# EAGLE design IR_Badge_2018 (EAGLE 9.1.1)
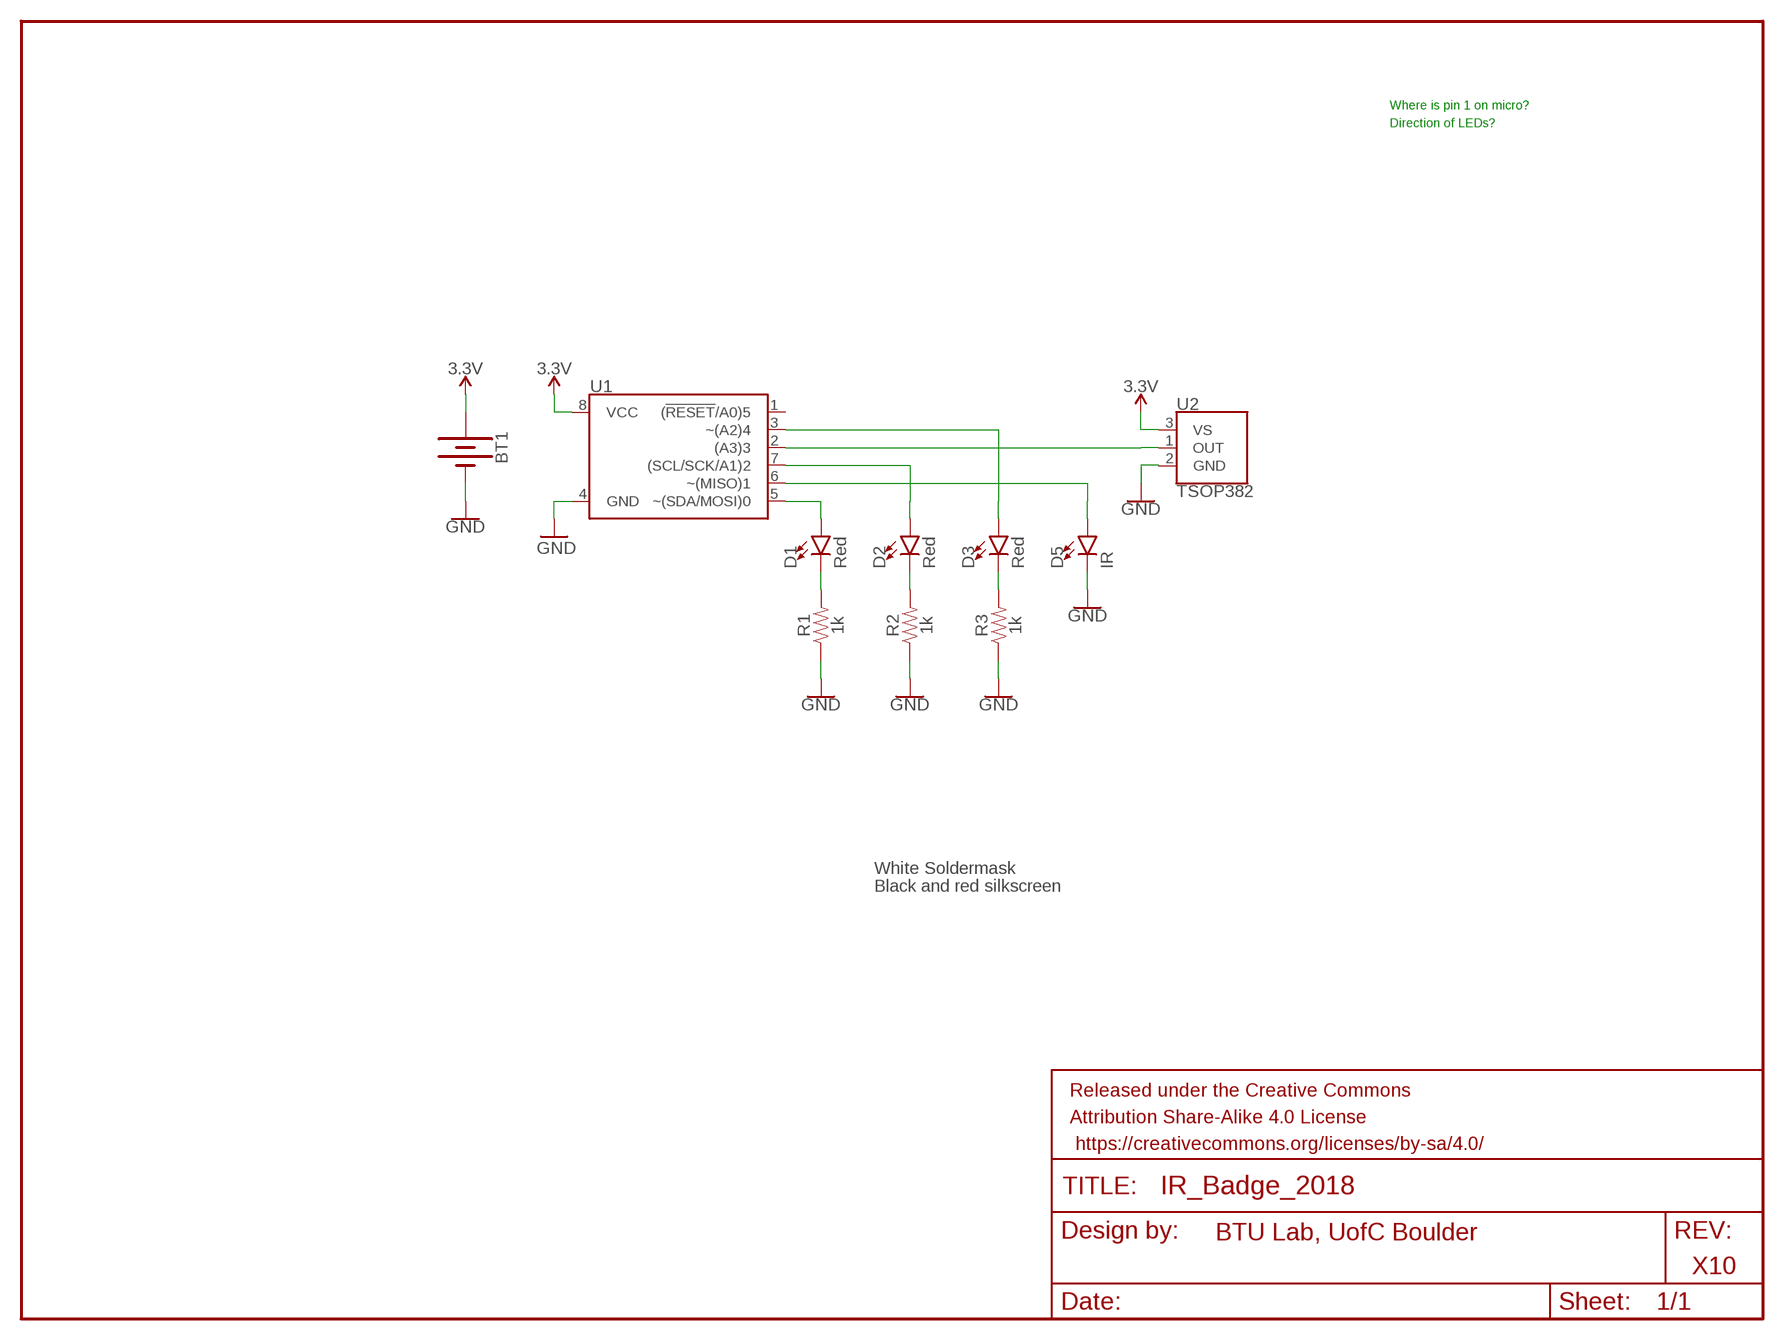
[diagram p0: schematic, sheet 1]

## Parts
BT1  BATTERY-20MM_PTH  [BATTCOM_20MM_PTH]
D1  Red  LEDRED  [LED_5MM_EXTRASILK]
D2  Red  LEDRED  [LED_5MM_EXTRASILK]
D3  Red  LEDRED  [LED_5MM_EXTRASILK]
D5  IR  LEDNS  [LED_5MM_NOSILK]
FRAME1  FRAME-LETTER  [CREATIVE_COMMONS]
R1  1k  RESISTOR  [RESISTOR]
R2  1k  RESISTOR  [RESISTOR]
R3  1k  RESISTOR  [RESISTOR]
U1  ATTINY85-ARDUINODIP  [DIP-8]
U2  TSOP382  [TSOP382-HORIZONTAL]

## Nets
3.3V: BT1.1(+) U1.8(VCC) U2.3(VS)
GND: BT1.2(-) D5.K(C) R1.P$1 R2.P$1 R3.P$1 U1.4(GND) U2.2(GND)
N$1: D1.A U1.5(~(SDA/MOSI)0)
N$2: D2.A U1.7((SCL/SCK/A1)2)
N$3: D1.K(C) R1.P$2
N$4: D3.A U1.3(~(A2)4)
N$5: D2.K(C) R2.P$2
N$7: D3.K(C) R3.P$2
N$8: D5.A U1.6(~(MISO)1)
N$9: U1.2((A3)3) U2.1(OUT)
Unconnected: U1.1((!RESET!/A0)5)

## Notes on the sheet
- Where is pin 1 on micro?
- Direction of LEDs?
- White Soldermask
- Black and red silkscreen
- BTU Lab, UofC Boulder
- X10

## Library data of the parts
BT1 = SparkFun-Batteries:BATTERY: Battery - Single Cell A variety of battery chemistries, sizes, and footprints. Device List: 20MM_PTH - Coin Cell Battery Holder - 20mm (PTH) <https://www.sparkfun.com/products/783> 20MM_PTH_KIT- Coin Cell battery Holder - 20 mm (PTH) <http://www.sparkfun.com/products/783>kit version with special mask 6.8MM_PTH - Coin Cell Battery Holder - 6.8MM(SMD) <https://www.digikey.com/product-detail/en/seiko-instruments/MS621FE-FL11E/728-1057-ND/1889208?WT.srch=1&gclid=CNOQ5a6LzdQCFZS2wAodXCkE0g> 12MM_SMD - Coin Cell Battery Holder - 12mm (SMD) <https://www.sparkfun.com/products/10592> 12MM_PTH - Coin Cell Battery Holder - 12mm (PTH) <https://www.sparkfun.com/products/7948> 20MM_SMD - 20mm Coin Cell Battery Holder (SMD) (2 legs) Used on the Big Time Watch Kit <https://www.sparkfun.com/products/11734> 20MM_SMD_4LEGS - Coin Cell Battery Holder - 20mm (SMD) <https://www.sparkfun.com/products/11892> 20MM_SMD_4LEGS_OVERPASTE - Coin Cell Battery Holder - 20mm (SMD) <https://www.sparkfun.com/products/11892> (Over-paste on the legs) 24.5MM_PTH - Coin Cell Battery Holder - 24.5mm (PTH) <https://www.sparkfun.com/products/8863> 9V - 9V Battery Holder - PC Mount Used on the SparkFun SparkPunk Sound Kit <https://www.sparkfun.com/products/11177> and SparkFun SparkPunk Sequencer Kit <https://www.sparkfun.com/products/12707> 18650 - Battery Holder - 18650 (PTH) <https://www.sparkfun.com/products/13113> AA - Battery Holder - 1xAA (PTH) <https://www.sparkfun.com/products/7949> AAA - Battery Holder - 1xAAA (PTH) <https://www.sparkfun.com/products/12718> AA_KIT - Battery Holder - 1xAA (PTH) <https://www.sparkfun.com/products/7949> Special kit package - pads only have exposed copper on one side of the board. AAA_KIT - Battery Holder - 1xAAA (PTH) <https://www.sparkfun.com/products/12718> Special kit package - pads only have exposed copper on one side of the board.; PROD_ID: BATT-09031; SF_SKU: PRT-00783
D1-D3 D5 = SparkX:LED
FRAME1 = SparkFun-Aesthetics:FRAME-LETTER: Schematic Frame - Letter Standard 8.5x11 US Letter frame
R1-R3 = esp8266_ir_blaster:RESISTOR
U1 = Redhat:ATTINY85-ARDUINO: Atmel 8-pin 2/4/8kB flash uC
U2 = esp8266_ir_blaster:TSOP382

## Board
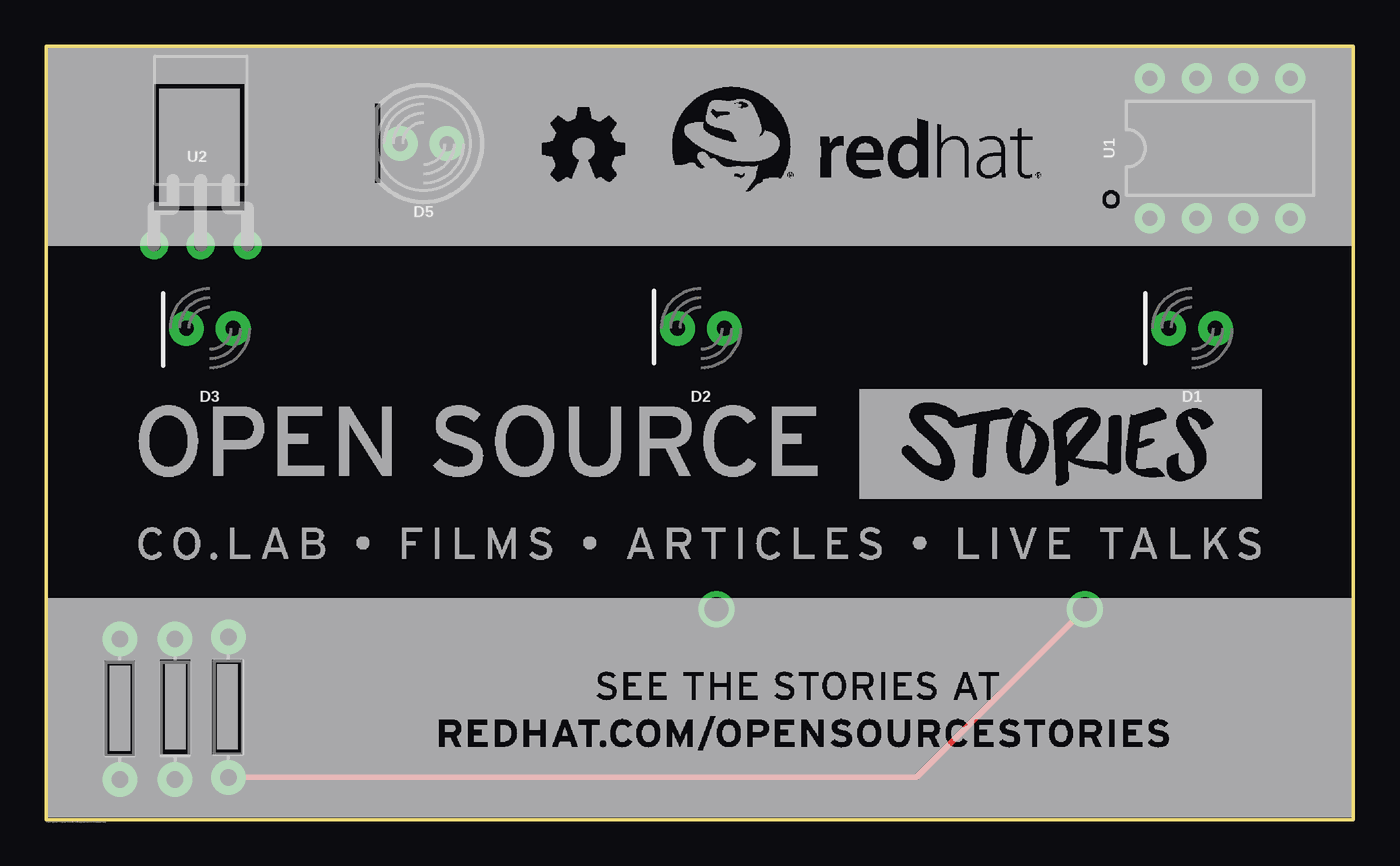
[diagram p1: board, top side]
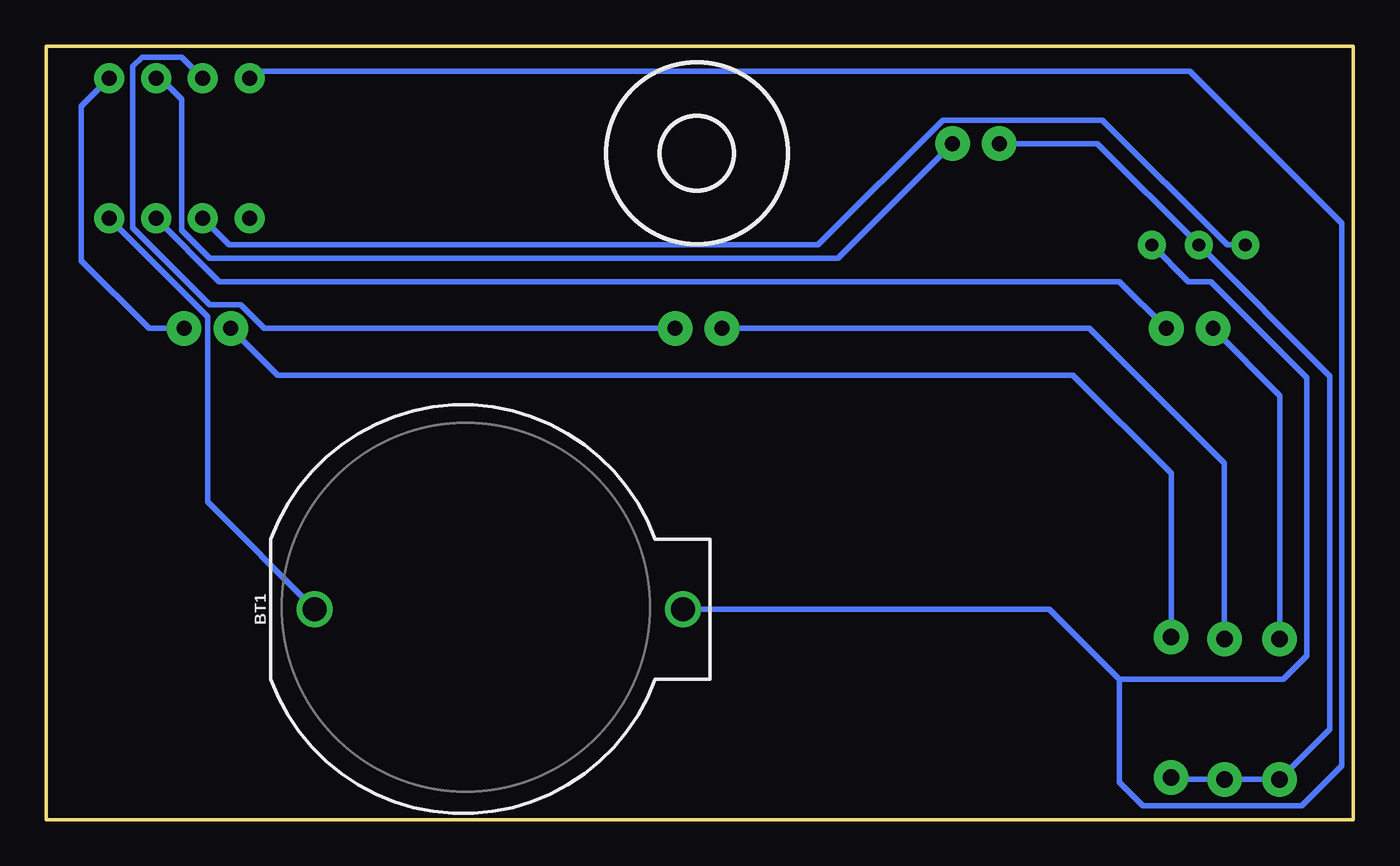
[diagram p2: board, bottom side, seen from below]

Size 71 x 42 mm. Coordinates in mm from the lower left corner, seen from the top.
Outline: 0,0 0,42 71,42 71,0 0,0
Copper layers (1*16): Top 0.035mm / dielectric 1.5mm / Bottom 0.035mm
Design rules "SparkFun-2-layer-TIGHT": minimum track width 7mil, minimum drill 15mil, track to track 7mil, track to pad 7mil, pad to pad 7mil, via to via 7mil, smd to smd 7mil, copper to edge 7mil, drill to drill 7mil, minimum pad ring 7mil, minimum via ring 7mil, stop-mask expansion 4mil, vias tented up to drill 25mil, thermal gap 10mil

### Footprints (pad centres in the part's own frame; a part is rotated, then mirrored left to right if it is on the bottom)
BATTCOM_20MM_PTH = drill 1.3: 1 11.85,0; 2 -8.15,0
LED_5MM_EXTRASILK = drill 0.813 pad 1.88: A -1.27,0; K 1.27,0
LED_5MM_NOSILK = drill 0.813 pad 1.88: A -1.27,0; K 1.27,0
RESISTOR = drill 0.9 pad 1.88: P$1 -3.81,0; P$2 3.81,0
DIP-8 = drill 0.813 pad 1.626: 1 -3.81,-3.81; 2 -1.27,-3.81; 3 1.27,-3.81; 4 3.81,-3.81; 5 3.81,3.81; 6 1.27,3.81; 7 -1.27,3.81; 8 -3.81,3.81
TSOP382-HORIZONTAL = drill 0.7 pad 1.524: 1 -2.54,0; 2 0,0; 3 2.54,0

### Placement (x,y rotation side)
BT1  48.26,11.43 0 bottom
D1  62.23,26.67 180 top
D2  35.56,26.67 180 top
D3  8.89,26.67 180 top
D5  20.5,36.7 180 top
FRAME1  -13.97,-21.59 0 top  (outside the outline)
R1  9.9,6.1 90 top
R2  7,6 90 top
R3  4,6 90 top
U1  63.76,36.45 0 top
U2  8.4,31.2 0 top

### Tracks (layer width: path | path; a pad name or v marks a point on that pad's centre or on a via)
3.3V
  Bottom 0.305: BT1.1 16.51,11.43 12.7,7.62 | 12.7,7.62 3.81,7.62 2.54,8.89 2.54,24.01 7.75,29.21 8.96,29.21 U2.3 | 12.7,7.62 12.7,2.04 11.43,0.77 2.8,0.77 0.64,2.92 0.64,32.39 8.89,40.64 59.57,40.64 U1.8
GND
  Top 0.305: BT1.2 47.27,2.29 R1.P$1
  Bottom 0.305: R1.P$1 9.8,2.19 R2.P$1 R3.P$1 1.27,4.92 1.27,24.07 U2.2 13.91,36.7 D5.K | U1.4 62.23,27.31 62.23,17.25 BT1.2
N$1
  Bottom 0.305: D1.A 65.41,26.67 69.09,30.36 69.09,38.74 U1.5
N$2
  Bottom 0.305: D2.A 59.17,26.67 60.44,27.94 62.11,27.94 66.3,32.13 66.3,40.9 65.79,41.41 63.63,41.41 U1.7
N$3
  Bottom 0.305: D1.K 58.42,24.13 15.23,24.13 9.9,18.8 R1.P$2
N$4
  Bottom 0.305: D3.A 12.7,29.21 61.6,29.21 U1.3
N$5
  Bottom 0.305: D2.K 14.34,26.67 7,19.34 R2.P$2
N$7
  Bottom 0.305: D3.K 7.62,26.64 4,23.02 R3.P$2
N$8
  Bottom 0.305: U1.6 64.77,40.26 63.63,39.12 63.63,32.01 62.11,30.48 27.99,30.48 D5.A
N$9
  Bottom 0.305: U2.1 6.86,31.2 13.63,37.97 22.3,37.97 29.07,31.2 61.05,31.2 61.09,31.25 61.41,31.56 U1.2

### Text on the board
tPlace: C:/Dropbox/Projects/RedHat_IRBadge/Artwork/Redhat-Art.bmp
tDocu: A. Gibb